# EAGLE design esp32_s20 (EAGLE 9.6.2)
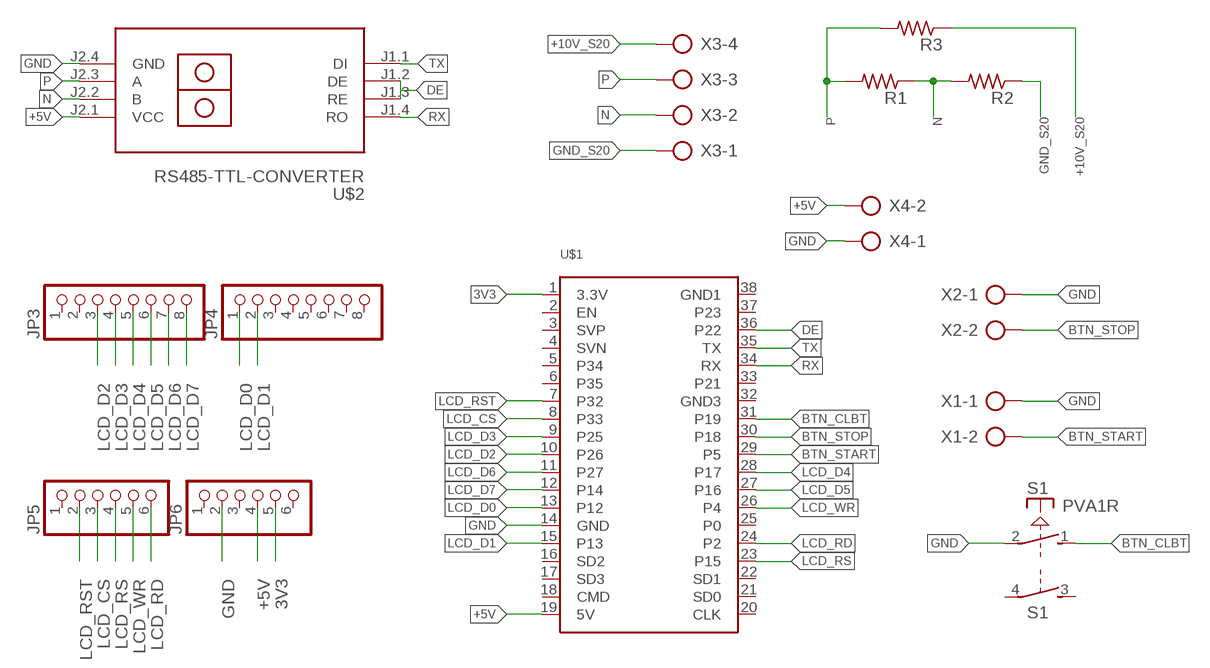
[diagram p0: schematic, sheet 1]

## Parts
JP3  PINHD-1X8  [1X08]
JP4  PINHD-1X8  [1X08]
JP5  PINHD-1X6  [1X06]
JP6  PINHD-1X6  [1X06]
R1  R-US_0204/7  [0204/7]
R2  R-US_0204/7  [0204/7]
R3  R-US_0204/7  [0204/7]
S1  PVA1R  [PVA1R]
U$1  ESP-32S  [BOARD]
U$2  RS485-TTL-CONVERTER  [RS485-TTL-CONVERTER]
X1  AK500/2-H  [AK500/2-H]
X2  AK500/2-H  [AK500/2-H]
X3  AK500/4-H  [AK500/4-H]
X4  AK500/2-H  [AK500/2-H]

## Nets
3V3: JP6.5 U$1.1(3.3V)
+5V: JP6.4 U$1.19(5V) U$2.J2.1(VCC) X4.2
+10V_S20: R3.1 X3.4
BTN_CLBT: S1.1(1:S) U$1.31(P19)
BTN_START: U$1.29(P5) X1.2
BTN_STOP: U$1.30(P18) X2.2
DE: U$1.36(P22) U$2.J1.2(DE) U$2.J1.3(RE)
GND: JP6.2 S1.2(1:P) U$1.14(GND) U$2.J2.4(GND) X1.1 X2.1 X4.1
GND_S20: R2.1 X3.1
LCD_CS: JP5.3 U$1.8(P33)
LCD_D0: JP4.1 U$1.13(P12)
LCD_D1: JP4.2 U$1.15(P13)
LCD_D2: JP3.3 U$1.10(P26)
LCD_D3: JP3.4 U$1.9(P25)
LCD_D4: JP3.5 U$1.28(P17)
LCD_D5: JP3.6 U$1.27(P16)
LCD_D6: JP3.7 U$1.11(P27)
LCD_D7: JP3.8 U$1.12(P14)
LCD_RD: JP5.6 U$1.24(P2)
LCD_RS: JP5.4 U$1.23(P15)
LCD_RST: JP5.2 U$1.7(P32)
LCD_WR: JP5.5 U$1.26(P4)
N: R1.1 R2.2 U$2.J2.2(B) X3.2
P: R1.2 R3.2 U$2.J2.3(A) X3.3
RX: U$1.34(RX) U$2.J1.4(RO)
TX: U$1.35(TX) U$2.J1.1(DI)
Unconnected: JP3.1 JP3.2 JP4.3 JP4.4 JP4.5 JP4.6 JP4.7 JP4.8 JP5.1 JP6.1 JP6.3 JP6.6 S1.3(2:S) S1.4(2:P) U$1.2(EN) U$1.3(SVP) U$1.4(SVN) U$1.5(P34) U$1.6(P35) U$1.16(SD2) U$1.17(SD3) U$1.18(CMD) U$1.20(CLK) U$1.21(SD0) U$1.22(SD1) U$1.25(P0) U$1.32(GND3) U$1.33(P21) U$1.37(P23) U$1.38(GND1)

## Library data of the parts
JP3 JP4 = pinhead:PINHD-1X8: PIN HEADER
JP5 JP6 = pinhead:PINHD-1X6: PIN HEADER
R1-R3 = BeagleBone_Black_Wireless:R-US_: RESISTOR, American symbol
S1 = switch-misc:PVA1R: ITT SWITCH
U$1 = esp32v1-1:ESP-32S: ESP-32S NODEMCU V1.1; MAKER: DarioBocc
U$2 = diy-modules:RS485-TTL-CONVERTER: RS485 to TTL converter based on MAX485 chip
X1 X2 X4 = con-ptr500:AK500/2-H: CONNECTOR Aug. 2004 / PTR Meßtechnik: Die Bezeichnung der Serie AK505 wurde geändert. Es handelt sich hierbei um AK500 in horizontaler Ausführung.; OC_FARNELL: unknown; OC_NEWARK: unknown
X3 = con-ptr500:AK500/4-H: CONNECTOR Aug. 2004 / PTR Meßtechnik: Die Bezeichnung der Serie AK505 wurde geändert. Es handelt sich hierbei um AK500 in horizontaler Ausführung.; OC_FARNELL: unknown; OC_NEWARK: unknown

## Net classes
1 power: width 0.61 mm, drill 0.711 mm, clearance 0.203 mm
2 gnd: width 0.305 mm, drill 0.711 mm, clearance 0.203 mm
3 usbvcc: width 0.508 mm, drill 0.711 mm, clearance 0.203 mm

## Board
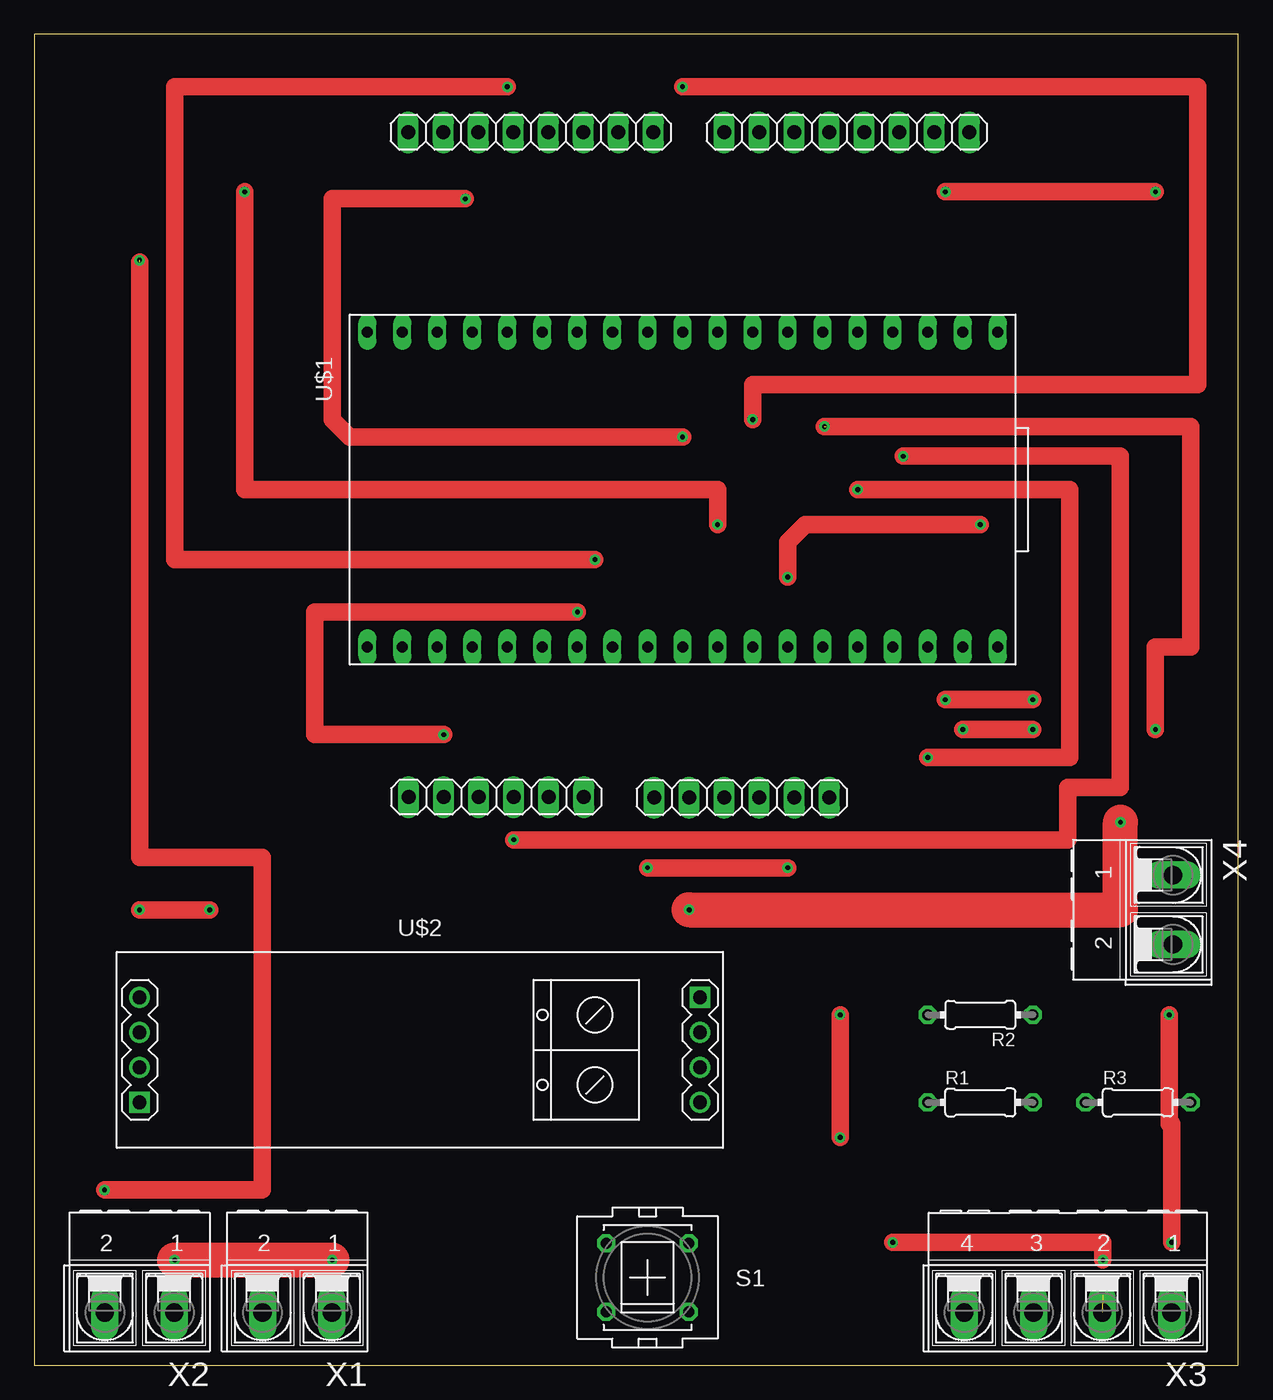
[diagram p1: board, top side]
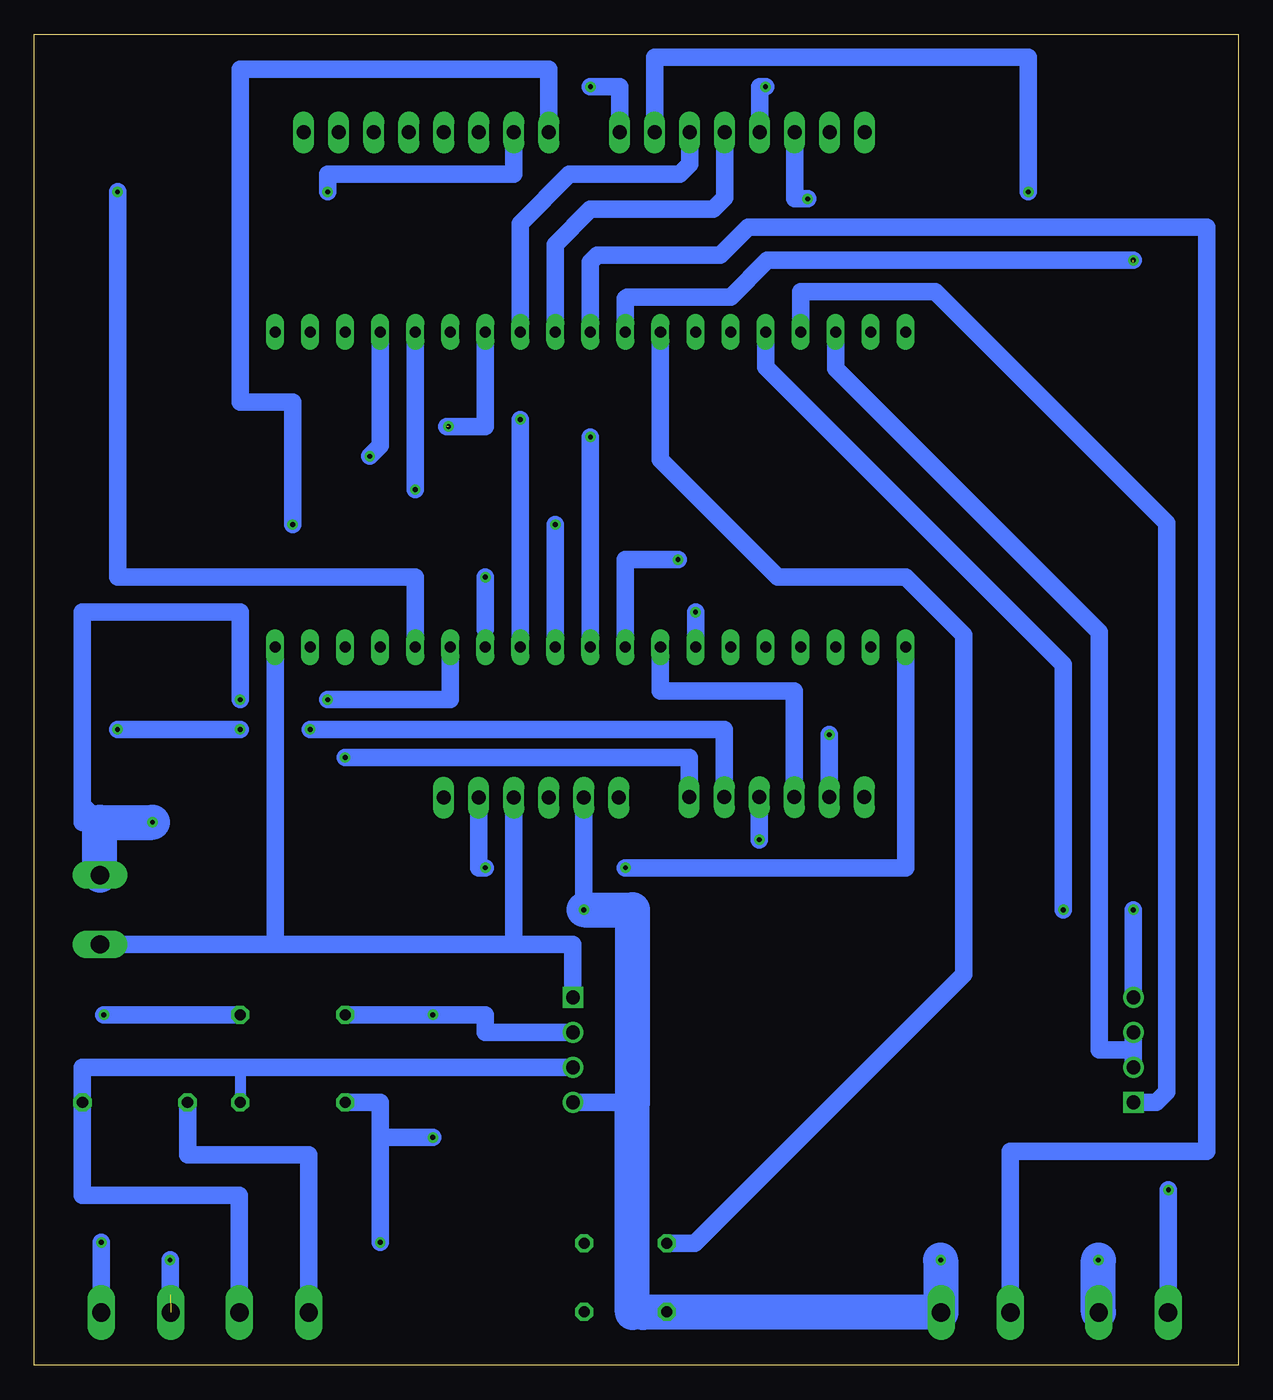
[diagram p2: board, bottom side, seen from below]

Size 87.3 x 96.51 mm. Coordinates in mm from the lower left corner, seen from the top.
Outline: 0,0 87.3,0 87.3,96.51 0,96.51 0,0
Copper layers (1*16): Top 0.035mm / dielectric 1.5mm / Bottom 0.035mm
Design rules "default": minimum track width 6mil, minimum drill 0.35mm, track to track 6mil, track to pad 6mil, pad to pad 6mil, via to via 6mil, smd to smd 6mil, copper to edge 40mil, drill to drill 6mil, minimum pad ring 10mil, minimum via ring 8mil, stop-mask expansion 4mil, vias tented up to drill 0mil, thermal gap 10mil

### Footprints (pad centres in the part's own frame; a part is rotated, then mirrored left to right if it is on the bottom)
1X08 = drill 1.016 long: 1 -8.89,0; 2 -6.35,0; 3 -3.81,0; 4 -1.27,0; 5 1.27,0; 6 3.81,0; 7 6.35,0; 8 8.89,0
1X06 = drill 1.016 long: 1 -6.35,0; 2 -3.81,0; 3 -1.27,0; 4 1.27,0; 5 3.81,0; 6 6.35,0
0204/7 = drill 0.813 octagon: 1 -3.81,0; 2 3.81,0
PVA1R = drill 0.813 octagon: 1 -2.997,2.489; 2 -2.997,-2.489; 3 2.997,2.489; 4 2.997,-2.489
BOARD = drill 0.8 long: 1 -11.43,22.86; 2 -11.43,20.32; 3 -11.43,17.78; 4 -11.43,15.24; 5 -11.43,12.7; 6 -11.43,10.16; 7 -11.43,7.62; 8 -11.43,5.08; 9 -11.43,2.54; 10 -11.43,0; 11 -11.43,-2.54; 12 -11.43,-5.08; 13 -11.43,-7.62; 14 -11.43,-10.16; 15 -11.43,-12.7; 16 -11.43,-15.24; 17 -11.43,-17.78; 18 -11.43,-20.32; 19 -11.43,-22.86; 20 11.43,-22.86; 21 11.43,-20.32; 22 11.43,-17.78; 23 11.43,-15.24; 24 11.43,-12.7; 25 11.43,-10.16; 26 11.43,-7.62; 27 11.43,-5.08; 28 11.43,-2.54; 29 11.43,0; 30 11.43,2.54; 31 11.43,5.08; 32 11.43,7.62; 33 11.43,10.16; 34 11.43,12.7; 35 11.43,15.24; 36 11.43,17.78; 37 11.43,20.32; 38 11.43,22.86
RS485-TTL-CONVERTER = drill 1 square: J1.1 -20.32,-3.81; J2.1 20.32,3.81 | drill 1: J1.2 -20.32,-1.27; J1.3 -20.32,1.27; J1.4 -20.32,3.81; J2.2 20.32,1.27; J2.3 20.32,-1.27; J2.4 20.32,-3.81
AK500/2-H = drill 1.321 long: 1 -2.515,0; 2 2.515,0
AK500/4-H = drill 1.321 long: 1 -7.518,0; 2 -2.489,0; 3 2.489,0; 4 7.518,0

### Placement (x,y rotation side)
JP3  35.99,89.42 0 top
JP4  58.89,89.42 0 top
JP5  33.48,41.2 0 top
JP6  51.28,41.16 0 top
R1  68.58,19.05 0 top
R2  68.58,25.4 180 top
R3  80.01,19.05 0 top
S1  44.45,6.35 0 top
U$1  46.99,63.5 90 top
U$2  27.94,22.86 0 top
X1  19.05,3.81 180 top
X2  7.62,3.81 180 top
X3  74.93,3.81 180 top
X4  82.55,33.02 270 top

### Tracks (layer width: path | path; a pad name or v marks a point on that pad's centre or on a via)
3V3  (via drill 0.35)
  Top 1.27: v44.45,36.07 v54.61,36.07
  Bottom 0.152: U$1.1 24.23,51.97
  Bottom 1.27: U$1.1 24.13,36.07 v44.45,36.07 | JP6.5 55.09,36.07 v54.61,36.07
+5V
  Bottom 1.27: 52.55,39.4 JP6.4 52.55,30.5 | X4.2 73.28,30.5 69.85,30.5 | 69.85,30.5 52.55,30.5 | 52.55,30.5 48.26,30.5 U$2.J2.1 | U$1.19 69.85,30.5
+10V_S20
  Bottom 0.152: 67.51,3.81 X3.4
  Bottom 0.813: 76.2,16.51 R3.1
  Bottom 1.27: X3.4 67.41,15.24 76.2,15.24 R3.1
BTN_CLBT
  Bottom 1.27: U$1.31 41.91,65.66 33.4,57.15 24.13,57.15 19.94,52.96 19.94,28.32 39.42,8.84 S1.1
BTN_START
  Bottom 1.27: X1.2 16.54,15.49 2.29,15.49 2.29,82.55 35.56,82.55 37.59,80.52 46.48,80.52 46.99,80.01 U$1.29
BTN_STOP  (via drill 0.35)  (1 unrouted)
  Top 1.27: v5.08,12.7 16.51,12.7 16.51,36.83 7.62,36.83 7.62,80.01
  Bottom 0.813: U$1.30 44.4,74.98
  Bottom 1.27: U$1.30 44.45,77.34 44.32,77.47 36.83,77.47 34.16,80.14 v7.62,80.14 | X2.2 5.08,3.81 v5.08,12.7
DE
  Bottom 1.27: U$1.36 29.21,72.26 10.1,53.15 10.1,22.86 7.62,22.86 | U$2.J1.3 7.62,22.86 | 7.62,22.86 U$2.J1.2
GND  (via drill 0.35)
  Top 1.27: 71.12,48.26 v72.39,48.26 v66.04,48.26
  Top 2.54: v10.16,7.62 v21.59,7.62 | v78.74,39.37 78.74,33.02 v47.47,33.02
  Bottom 0.152: 47.55,41.15 JP6.2 | 21.49,3.81 X1.1 | 41.45,3.81 S1.2
  Bottom 0.813: X1.1 21.59,3.81 | 40.64,3.81 41.45,3.81
  Bottom 1.27: 43.94,3.81 43.18,3.81 40.64,3.81 21.59,3.81 | U$2.J2.4 43.94,19.05 | v47.47,33.02 JP6.2 | v72.39,48.26 72.39,54.61 83.82,54.61 83.82,40.64 | U$1.14 57.15,48.26 v66.04,48.26 | 83.82,40.64 83.82,39.37 82.55,39.37 83.82,40.64
  Bottom 2.54: v21.59,7.62 21.59,3.81 | X1.1 43.18,3.81 | 43.94,3.81 43.94,19.05 43.94,33.02 v47.47,33.02 | X2.1 10.16,3.83 v10.16,7.62 | X4.1 82.55,39.37 v78.74,39.37
GND_S20  (via drill 0.35)
  Top 1.27: v82.45,8.89 82.45,17.5 82.27,17.5 v82.27,25.4
  Bottom 0.152: 72.39,25.3 R2.1
  Bottom 1.27: X3.1 v82.45,8.89 | v82.27,25.4 R2.1
LCD_CS
  Bottom 0.152: 32.16,41.3 JP5.3
  Bottom 1.27: JP5.3 32.21,48.9 41.91,48.9 U$1.8
LCD_D0  (via drill 0.35)
  Top 1.27: v68.58,60.96 55.88,60.96 54.61,59.69 v54.61,57.15
  Bottom 0.152: 50.14,89.46 JP4.1
  Bottom 0.813: U$1.13 54.61,53.34 54.61,54.32
  Bottom 1.27: JP4.1 50,93.98 72.39,93.98 72.39,69.85 68.58,69.85 v68.58,60.96 | 54.61,53.34 v54.61,57.15
LCD_D1  (via drill 0.35)
  Top 1.27: v81.28,85.09 v66.04,85.09
  Bottom 0.152: 52.58,89.31 JP4.2
  Bottom 1.27: U$1.15 59.69,57.15 81.28,57.15 v81.28,85.09 | JP4.2 52.54,86.36 66.04,86.36 v66.04,85.09
LCD_D2  (via drill 0.35)
  Top 1.27: 46.28,67.31 v46.99,67.31 22.86,67.31 21.59,68.58 21.59,84.58 v31.24,84.58
  Bottom 0.152: 46.94,51.97 U$1.10
  Bottom 1.27: U$1.10 v46.99,67.31 | JP3.3 32.18,84.58 v31.24,84.58
LCD_D3  (via drill 0.35)
  Top 1.27: v40.64,58.42 10.16,58.42 10.16,92.71 v34.29,92.71
  Bottom 0.813: U$1.9 44.45,53.47
  Bottom 1.27: v40.64,58.42 44.45,58.42 U$1.9 | JP3.4 34.72,92.71 v34.29,92.71
LCD_D4
  Bottom 1.27: U$1.28 49.53,81.28 46.99,83.82 38.1,83.82 37.26,84.66 JP3.5
LCD_D5
  Bottom 1.27: JP3.6 39.8,87.08 40.52,86.36 48.51,86.36 52.07,82.8 U$1.27
LCD_D6  (via drill 0.35)
  Top 1.27: v49.53,60.96 49.53,63.5 15.24,63.5 v15.24,85.09
  Bottom 1.27: U$1.11 v49.53,60.96 | v15.24,85.09 15.24,94.86 42.34,94.86 JP3.7
LCD_D7  (via drill 0.35)
  Top 1.27: v52.07,68.58 52.07,71.12 84.33,71.12 84.33,92.71 v46.99,92.71
  Bottom 1.27: U$1.12 v52.07,68.58 | JP3.8 44.88,92.71 v46.99,92.71
LCD_RD  (via drill 0.35)
  Top 1.27: v59.69,63.5 75.06,63.5 75.06,44.07 v64.77,44.07
  Bottom 0.813: JP5.6
  Bottom 1.27: 59.69,64.77 v59.69,63.5 U$1.24 | JP5.6 39.83,44.07 v64.77,44.07
LCD_RS  (via drill 0.35)
  Top 1.27: v34.75,38.1 74.93,38.1 74.93,41.91 78.74,41.91 78.74,65.91 v62.99,65.91
  Bottom 1.27: JP5.4 v34.75,38.1 | v62.99,65.91 62.23,66.67 U$1.23
LCD_RST  (via drill 0.35)
  Top 1.27: 29.21,45.72 v29.67,45.72 20.32,45.72 20.32,54.61 v39.37,54.61
  Bottom 1.27: JP5.2 v29.67,45.72 | U$1.7 v39.37,54.61
LCD_WR  (via drill 0.35)  (1 unrouted)
  Top 1.27: v67.31,46.1 v72.39,46.1 | 81.28,46.99 v81.28,46.1 81.28,52.07 83.82,52.07 83.82,68.07 v57.28,68.07
  Bottom 0.152: 54.56,74.83 U$1.26
  Bottom 1.27: JP5.5 37.29,46.1 v67.31,46.1 | v72.39,46.1 v81.28,46.1 | U$1.26 54.61,68.07 57.4,68.07
N  (via drill 0.35)  (1 unrouted)
  Top 1.27: v62.23,8.89 77.47,8.89 v77.47,7.62 | v58.42,16.51 v58.42,25.4
  Bottom 0.152: 48.16,24.08 U$2.J2.2 | 64.77,25.3 R2.2
  Bottom 1.27: R1.1 62.23,19.05 62.23,16.51 | 62.23,16.51 v62.23,8.89 | v77.47,7.62 77.47,5.08 | 62.23,16.51 v58.42,16.51 | v58.42,25.4 59.69,25.4 | R2.2 v58.42,25.4 | U$2.J2.2 54.61,24.13 54.61,25.4 v58.42,25.4
P
  Bottom 0.152: 48.31,21.49 U$2.J2.3
  Bottom 0.813: 83.82,16.51 R3.2 83.82,21.59 | 72.39,21.59 R1.2
  Bottom 1.27: X3.3 72.44,12.32 83.82,12.32 83.82,16.51 83.82,21.59 72.39,21.59 U$2.J2.3
RX  (via drill 0.35)
  Top 1.27: v7.62,33.02 v12.7,33.02
  Bottom 1.27: U$2.J1.4 v7.62,33.02 | v12.7,33.02 12.7,50.8 34.29,72.39 U$1.34
TX
  Bottom 0.152: 31.7,74.98 U$1.35
  Bottom 1.27: U$2.J1.1 5.97,19.05 5.21,19.81 5.21,61.09 21.97,77.85 31.75,77.85 U$1.35